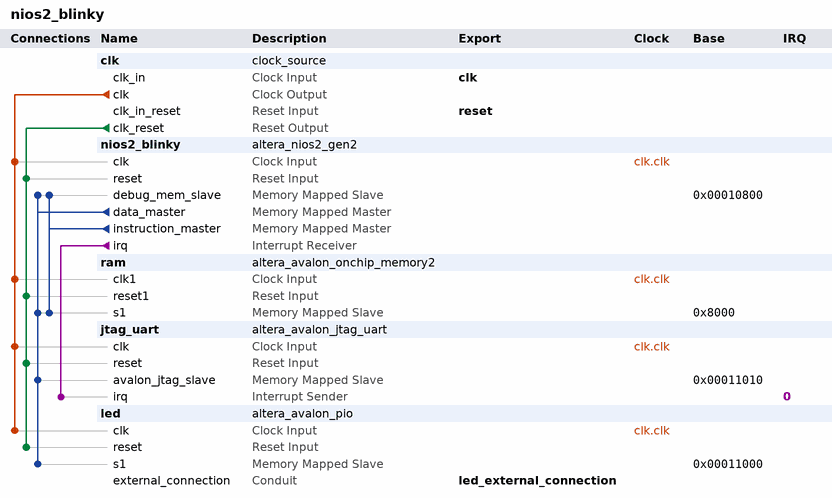
[diagram p0: system contents]
# Platform Designer (Qsys) system nios2_blinky, Cyclone V 5CSEMA5F31C6
# Parameters at their usual value, and those the tool derives, are not listed.
package require -exact qsys 18.1
create_system nios2_blinky
set_project_property DEVICE_FAMILY {Cyclone V}
set_project_property DEVICE 5CSEMA5F31C6

add_instance clk clock_source 18.1
set_instance_parameter_value clk clockFrequency 50000000

add_instance nios2_blinky altera_nios2_gen2 18.1
set_instance_parameter_value nios2_blinky dcache_size 2048
set_instance_parameter_value nios2_blinky exceptionSlave ram.s1
set_instance_parameter_value nios2_blinky icache_size 4096
set_instance_parameter_value nios2_blinky impl Tiny
set_instance_parameter_value nios2_blinky resetSlave ram.s1

add_instance ram altera_avalon_onchip_memory2 18.1
set_instance_parameter_value ram dataWidth 32
set_instance_parameter_value ram dualPort false
set_instance_parameter_value ram initMemContent true
set_instance_parameter_value ram initializationFileName onchip_mem.hex
set_instance_parameter_value ram memorySize 20480

add_instance jtag_uart altera_avalon_jtag_uart 18.1
set_instance_parameter_value jtag_uart simInteractiveOptions NO_INTERACTIVE_WINDOWS

add_instance led altera_avalon_pio 18.1
set_instance_parameter_value led direction Output
set_instance_parameter_value led width 1

# connections
add_connection clk.clk jtag_uart.clk clock
add_connection clk.clk led.clk clock
add_connection clk.clk nios2_blinky.clk clock
add_connection clk.clk ram.clk1 clock
add_connection clk.clk_reset jtag_uart.reset reset
add_connection clk.clk_reset led.reset reset
add_connection clk.clk_reset nios2_blinky.reset reset
add_connection clk.clk_reset ram.reset1 reset
add_connection nios2_blinky.data_master jtag_uart.avalon_jtag_slave avalon
set_connection_parameter_value nios2_blinky.data_master/jtag_uart.avalon_jtag_slave baseAddress 0x00011010
add_connection nios2_blinky.data_master led.s1 avalon
set_connection_parameter_value nios2_blinky.data_master/led.s1 baseAddress 0x00011000
add_connection nios2_blinky.data_master nios2_blinky.debug_mem_slave avalon
set_connection_parameter_value nios2_blinky.data_master/nios2_blinky.debug_mem_slave baseAddress 0x00010800
add_connection nios2_blinky.data_master ram.s1 avalon
set_connection_parameter_value nios2_blinky.data_master/ram.s1 baseAddress 0x8000
add_connection nios2_blinky.instruction_master nios2_blinky.debug_mem_slave avalon
set_connection_parameter_value nios2_blinky.instruction_master/nios2_blinky.debug_mem_slave baseAddress 0x00010800
add_connection nios2_blinky.instruction_master ram.s1 avalon
set_connection_parameter_value nios2_blinky.instruction_master/ram.s1 baseAddress 0x8000
add_connection nios2_blinky.irq jtag_uart.irq interrupt
set_connection_parameter_value nios2_blinky.irq/jtag_uart.irq irqNumber 0

# exported interfaces
add_interface clk clock sink
set_interface_property clk EXPORT_OF clk.clk_in
add_interface led_external_connection conduit end
set_interface_property led_external_connection EXPORT_OF led.external_connection
add_interface reset reset sink
set_interface_property reset EXPORT_OF clk.clk_in_reset

set_interconnect_requirement {$system} qsys_mm.clockCrossingAdapter HANDSHAKE
set_interconnect_requirement {$system} qsys_mm.enableEccProtection FALSE
set_interconnect_requirement {$system} qsys_mm.insertDefaultSlave FALSE
set_interconnect_requirement {$system} qsys_mm.maxAdditionalLatency 1

save_system nios2_blinky.qsys
